# Altium schematic sheet NASCO A4.SchDoc
size A4; Title2: Title2

## Parts
?  (no value)  (no BOM)

## Notes on the sheet
- Title
- NASCO
- Size:
- Date:
- A4
- Number:
- Revision:
- Sheet
- of
- File:

## Library data of the parts
? = NASCO_LOGO: LOGO